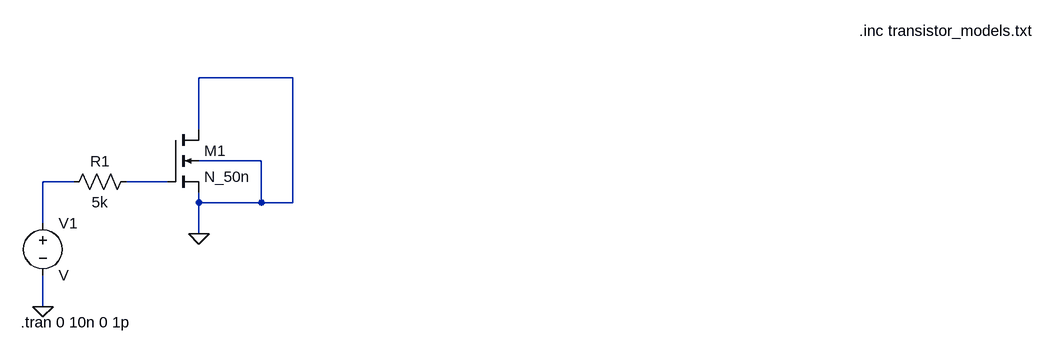
[diagram p0: schematic nmos_C_extract.asc]
nmos_C_extract.asc, the LTspice schematic file:
Version 4
SHEET 1 1140 680
WIRE -32 -48 -176 -48
WIRE -176 32 -176 -48
WIRE -80 80 -176 80
WIRE -368 112 -416 112
WIRE -224 112 -288 112
WIRE -176 144 -176 128
WIRE -80 144 -80 80
WIRE -80 144 -176 144
WIRE -32 144 -32 -48
WIRE -32 144 -80 144
WIRE -416 176 -416 112
WIRE -176 192 -176 144
WIRE -416 304 -416 256
FLAG -176 192 0
FLAG -416 304 0
SYMBOL nmos4 -224 32 R0
SYMATTR InstName M1
SYMATTR Value N_50n
SYMATTR Value2 l=50n w=500n
SYMBOL voltage -416 160 R0
SYMATTR InstName V1
SYMBOL res -272 96 R90
WINDOW 0 0 56 VBottom 2
WINDOW 3 32 56 VTop 2
SYMATTR InstName R1
SYMATTR Value 5k
TEXT -450 328 Left 2 !.tran 0 10n 0 1p
TEXT 840 -120 Left 2 !.inc transistor_models.txt

The netlist it stands for:
* nmos_C_extract.asc
M1 0 N002 0 0 N_50n l=50n w=500n
V1 N001 0 V
R1 N002 N001 5k
.model NMOS NMOS
.model PMOS PMOS
.lib standard.mos
.tran 0 10n 0 1p
.inc transistor_models.txt
.backanno
.end